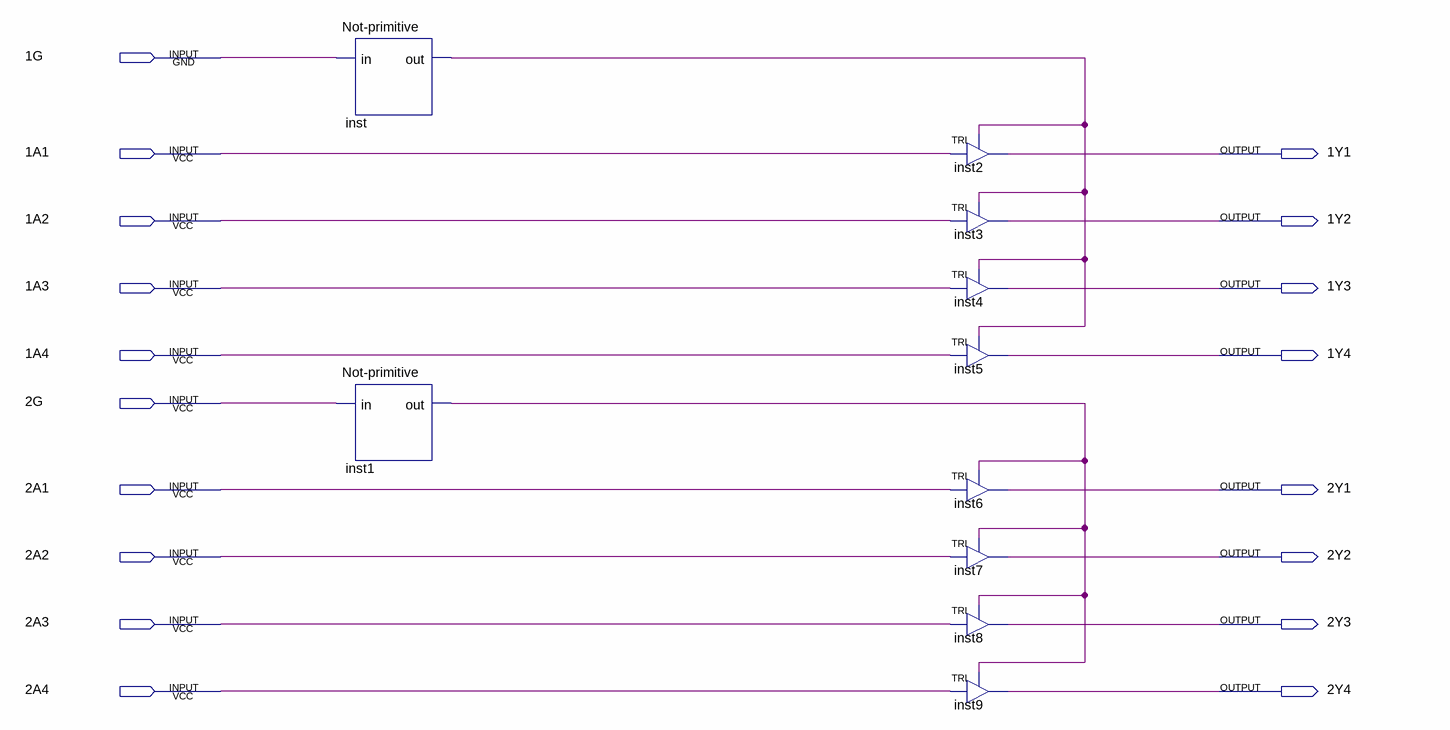
[diagram p0: schematic sheet]
// Quartus schematic 74244-Octal-Buffer.bdf as structural Verilog: 10 symbols, 18 pins
module \74244-Octal-Buffer  (
  input  \1G ,
  input  \1A1 ,
  input  \1A2 ,
  input  \1A3 ,
  input  \1A4 ,
  input  \2G ,
  input  \2A1 ,
  input  \2A2 ,
  input  \2A3 ,
  input  \2A4 ,
  output \1Y1 ,
  output \1Y2 ,
  output \1Y3 ,
  output \1Y4 ,
  output \2Y1 ,
  output \2Y2 ,
  output \2Y3 ,
  output \2Y4 
);

  wire inst1_out, inst_out;

  \Not-primitive  inst (.in(\1G ), .out(inst_out));
  \Not-primitive  inst1 (.in(\2G ), .out(inst1_out));
  TRI inst2 (.IN(\1A1 ), .OE(inst_out), .OUT(\1Y1 ));
  TRI inst3 (.IN(\1A2 ), .OE(inst_out), .OUT(\1Y2 ));
  TRI inst4 (.IN(\1A3 ), .OE(inst_out), .OUT(\1Y3 ));
  TRI inst5 (.IN(\1A4 ), .OE(inst_out), .OUT(\1Y4 ));
  TRI inst6 (.IN(\2A1 ), .OE(inst1_out), .OUT(\2Y1 ));
  TRI inst7 (.IN(\2A2 ), .OE(inst1_out), .OUT(\2Y2 ));
  TRI inst8 (.IN(\2A3 ), .OE(inst1_out), .OUT(\2Y3 ));
  TRI inst9 (.IN(\2A4 ), .OE(inst1_out), .OUT(\2Y4 ));
endmodule
